# Altium schematic sheet L50T-MAUe.SchDoc
size A3
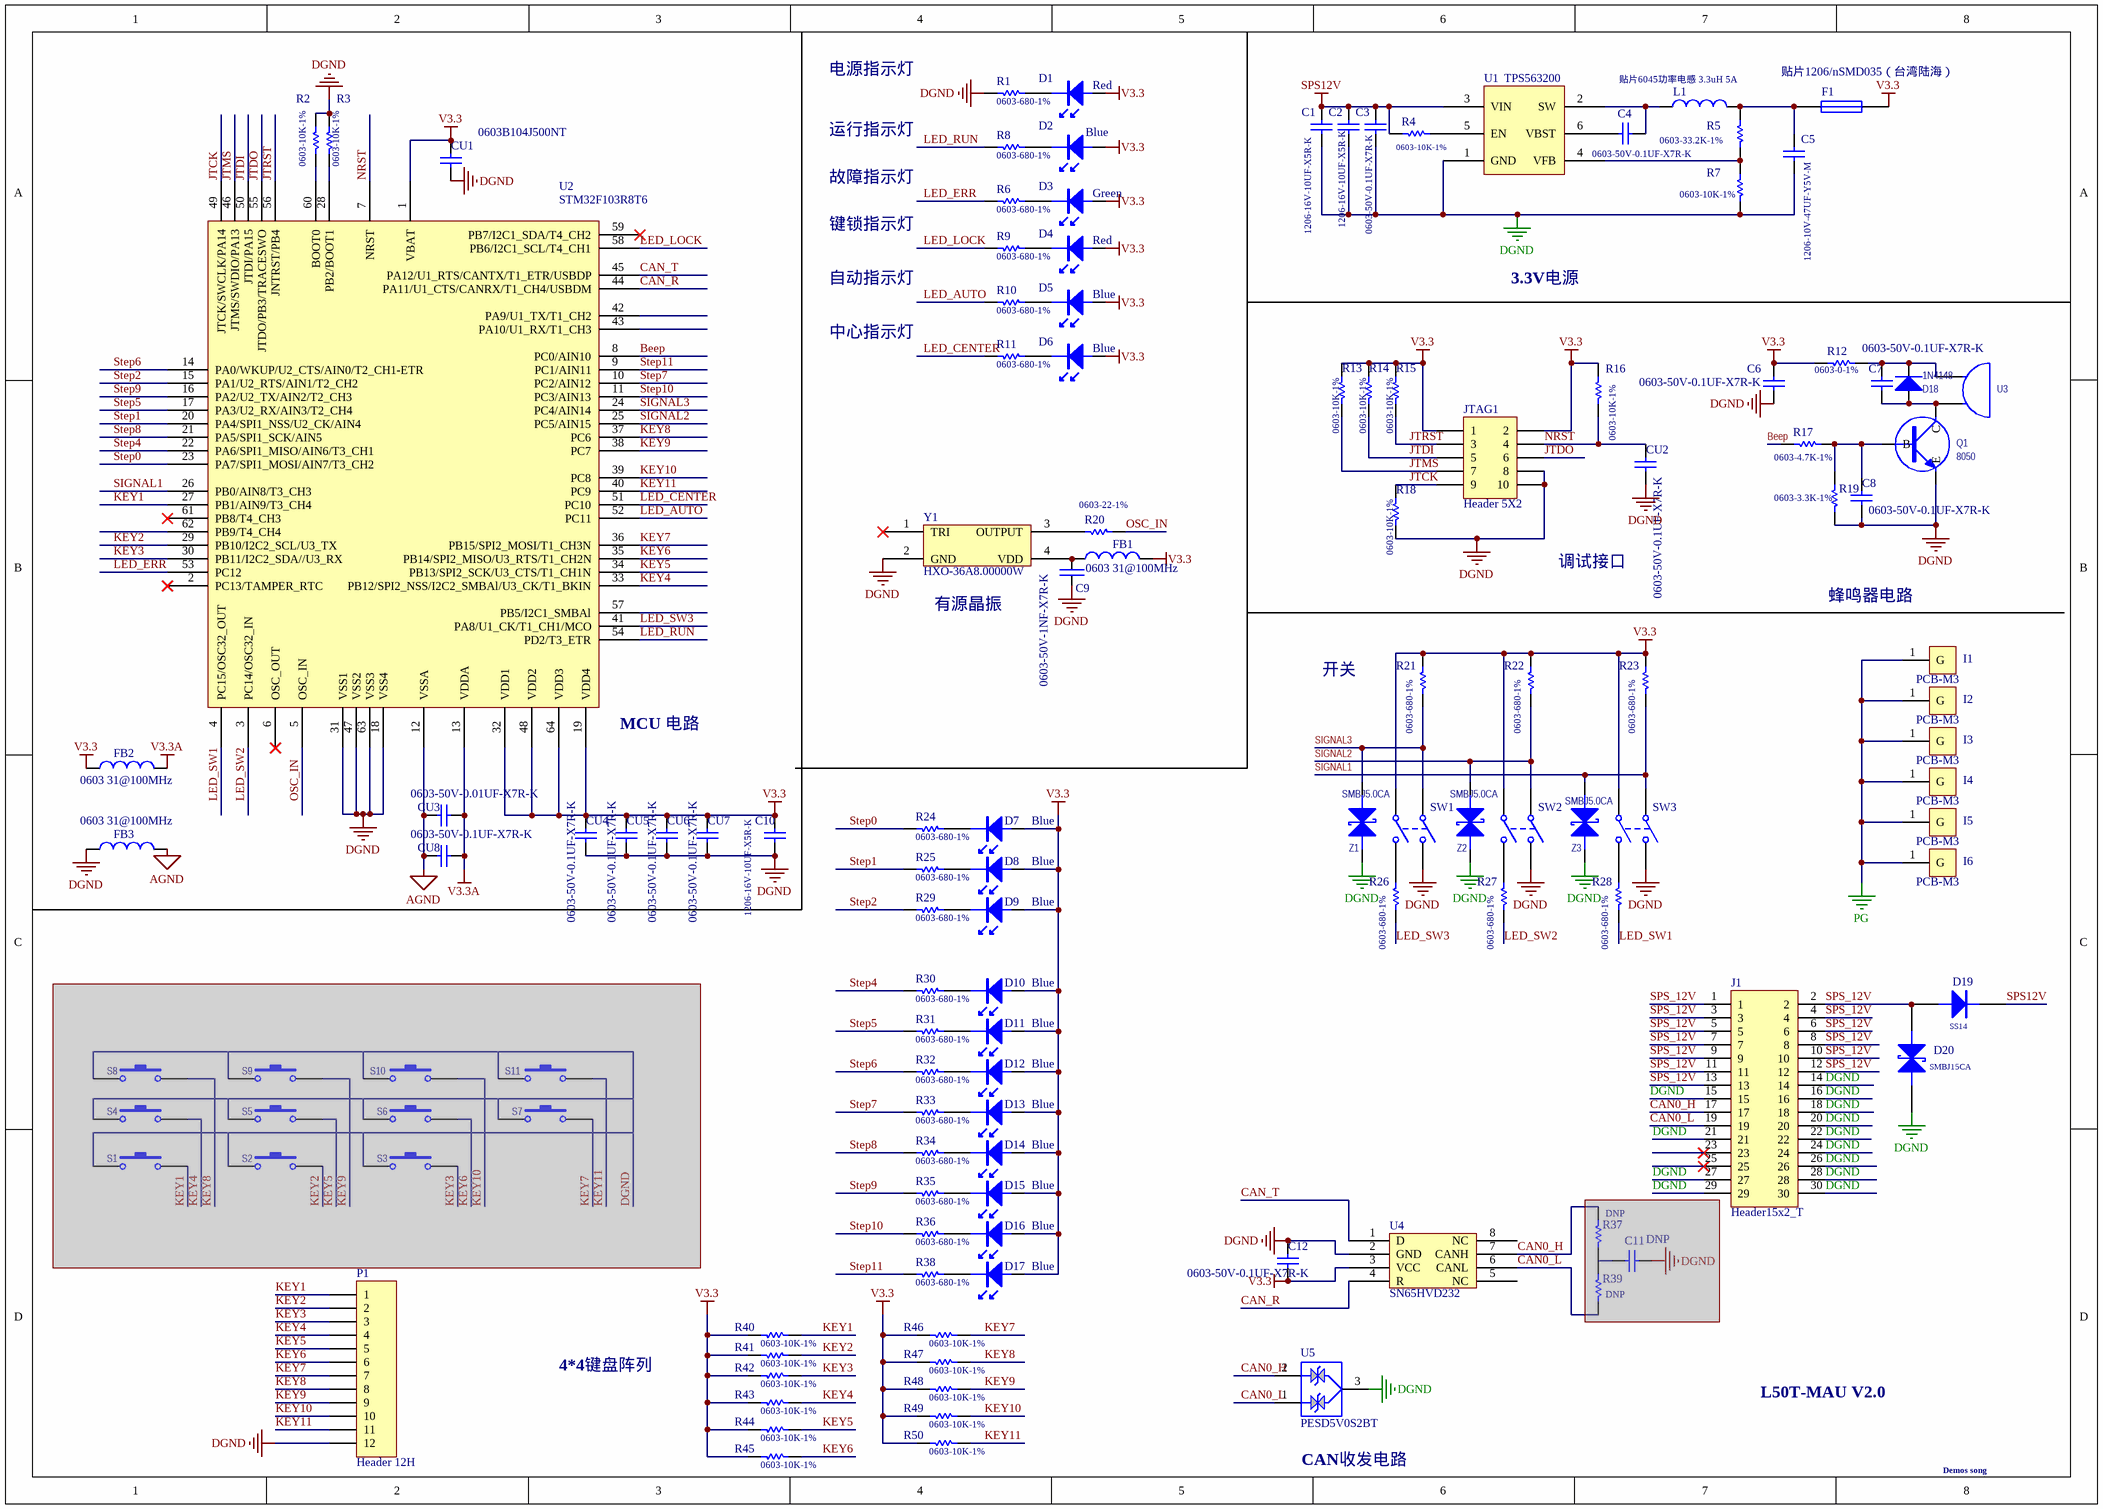
[diagram p0: L50T-MAUe.SchDoc]

## Parts
C1  1206-16V-10UF-X5R-K  [1206C]
C2  1206-16V-10UF-X5R-K  [1206C]
C3  0603-50V-0.1UF-X7R-K  [0603C]
C4  0603-50V-0.1UF-X7R-K  [0603C]
C5  1206-10V-47UF-Y5V-M  [1206C]
C6  0603-50V-0.1UF-X7R-K  [0603C]
C7  0603-50V-0.1UF-X7R-K  [0603C]
C8  0603-50V-0.1UF-X7R-K  [0603C]
C9  0603-50V-1NF-X7R-K  [0603c]
C10  1206-16V-10UF-X5R-K  [1206C]
C11  DNP  [0603C]  (masked out: inside a compile mask, not in the netlist)
C12  0603-50V-0.1UF-X7R-K  [0603C]
CU1  value 0603B104J500NT  [0603C]  (hidden comment: 0603-50V-0.1UF-X7R-K)
CU2  0603-50V-0.1UF-X7R-K  [0603C]
CU3  0603-50V-0.01UF-X7R-K  [0603C]
CU4  0603-50V-0.1UF-X7R-K  [0603C]
CU5  0603-50V-0.1UF-X7R-K  [0603C]
CU6  0603-50V-0.1UF-X7R-K  [0603C]
CU7  0603-50V-0.1UF-X7R-K  [0603C]
CU8  0603-50V-0.1UF-X7R-K  [0603C]
D1  Red  [1206LED-B]
D2  Blue  [1206LED-B]
D3  Green  [1206LED-B]
D4  Red  [1206LED-B]
D5  Blue  [1206LED-B]
D6  Blue  [1206LED-B]
D7  Blue  [LED-KEY]
D8  Blue  [LED-KEY]
D9  Blue  [LED-KEY]
D10  Blue  [LED-KEY]
D11  Blue  [LED-KEY]
D12  Blue  [LED-KEY]
D13  Blue  [LED-KEY]
D14  Blue  [LED-KEY]
D15  Blue  [LED-KEY]
D16  Blue  [LED-KEY]
D17  Blue  [LED-KEY]
D18  1N4148  [SOD-323]
D19  SS14  [SMA]
D20  SMBJ15CA  [SMB-TVS]
F1  贴片1206/nSMD035（台湾陆海）  [1206F]
FB1  0603 31@100MHz  [0603L]
FB2  0603 31@100MHz  [0603L]
FB3  0603 31@100MHz  [0603L]
I1  PCB-M3  [PADS_M3]
I2  PCB-M3  [PADS_M3]
I3  PCB-M3  [PADS_M3]
I4  PCB-M3  [PADS_M3]
I5  PCB-M3  [PADS_M3]
I6  PCB-M3  [PADS_M3]
J1  Header15x2_T  [IDC-30-2.0T]
JTAG1  Header 5X2  [IDC-10-SMT]
L1  贴片6045功率电感 3.3uH 5A  [L-6045]
P1  Header 12H  [XPHD101-12-A01]
Q1  8050  [SOT-23]
R1  0603-680-1%  [0603R]
R2  0603-10K-1%  [0603R]
R3  0603-10K-1%  [0603R]
R4  0603-10K-1%  [0603R]
R5  0603-33.2K-1%  [0603R]
R6  0603-680-1%  [0603R]
R7  0603-10K-1%  [0603R]
R8  0603-680-1%  [0603R]
R9  0603-680-1%  [0603R]
R10  0603-680-1%  [0603R]
R11  0603-680-1%  [0603R]
R12  0603-0-1%  [0603R]
R13  0603-10K-1%  [0603R]
R14  0603-10K-1%  [0603R]
R15  0603-10K-1%  [0603R]
R16  0603-10K-1%  [0603R]
R17  0603-4.7K-1%  [0603R]
R18  0603-10K-1%  [0603R]
R19  0603-3.3K-1%  [0603R]
R20  0603-22-1%  [0603R]
R21  0603-680-1%  [0603R]
R22  0603-680-1%  [0603R]
R23  0603-680-1%  [0603R]
R24  0603-680-1%  [0603R]
R25  0603-680-1%  [0603R]
R26  0603-680-1%  [0603R]
R27  0603-680-1%  [0603R]
R28  0603-680-1%  [0603R]
R29  0603-680-1%  [0603R]
R30  0603-680-1%  [0603R]
R31  0603-680-1%  [0603R]
R32  0603-680-1%  [0603R]
R33  0603-680-1%  [0603R]
R34  0603-680-1%  [0603R]
R35  0603-680-1%  [0603R]
R36  0603-680-1%  [0603R]
R37  DNP  [0603R]  (masked out: inside a compile mask, not in the netlist)
R38  0603-680-1%  [0603R]
R39  DNP  [0603R]  (masked out: inside a compile mask, not in the netlist)
R40  0603-10K-1%  [0603R]
R41  0603-10K-1%  [0603R]
R42  0603-10K-1%  [0603R]
R43  0603-10K-1%  [0603R]
R44  0603-10K-1%  [0603R]
R45  0603-10K-1%  [0603R]
R46  0603-10K-1%  [0603R]
R47  0603-10K-1%  [0603R]
R48  0603-10K-1%  [0603R]
R49  0603-10K-1%  [0603R]
R50  0603-10K-1%  [0603R]
S1  SW-PB  [SKRR]  (value not drawn)  (masked out: inside a compile mask, not in the netlist)
S2  SW-PB  [SKRR]  (value not drawn)  (masked out: inside a compile mask, not in the netlist)
S3  SW-PB  [SKRR]  (value not drawn)  (masked out: inside a compile mask, not in the netlist)
S4  SW-PB  [SKRR]  (value not drawn)  (masked out: inside a compile mask, not in the netlist)
S5  SW-PB  [SKRR]  (value not drawn)  (masked out: inside a compile mask, not in the netlist)
S6  SW-PB  [SKRR]  (value not drawn)  (masked out: inside a compile mask, not in the netlist)
S7  SW-PB  [SKRR]  (value not drawn)  (masked out: inside a compile mask, not in the netlist)
S8  SW-PB  [SKRR]  (value not drawn)  (masked out: inside a compile mask, not in the netlist)
S9  SW-PB  [SKRR]  (value not drawn)  (masked out: inside a compile mask, not in the netlist)
S10  SW-PB  [SKRR]  (value not drawn)  (masked out: inside a compile mask, not in the netlist)
S11  SW-PB  [SKRR]  (value not drawn)  (masked out: inside a compile mask, not in the netlist)
SW1  SW-DPST  [J-19-471]  (value not drawn)
SW2  SW-DPST  [J-19-471]  (value not drawn)
SW3  SW-DPST  [J-19-471]  (value not drawn)
U1  TPS563200  [TSOT23-6]
U2  STM32F103R8T6  [STM-LQFP64_N]
U3  BUZZER  [BUZZ-.28/.46 -SMT]  (value not drawn)
U4  SN65HVD232  [SO-8]
U5  PESD5V0S2BT  [SOT-23]
Y1  HXO-36A8.00000W  [XTAL-C]
Z1  SMBJ5.0CA  [SMB-TVS]
Z2  SMBJ5.0CA  [SMB-TVS]
Z3  SMBJ5.0CA  [SMB-TVS]

## Nets
AGND: CU3.2 CU8.2 FB3.2 U2.12(VSSA)
DGND: C1.1 C2.1 C3.2 C5.1 C6.2 C8.1 C9.2 C10.1 C12.2 CU1.1 CU2.1 CU4.1 CU5.1 CU6.1 CU7.1 D20.1(A) FB3.1 J1.14 J1.15 J1.16 J1.18 J1.20 J1.21 J1.22 J1.24 J1.26 J1.27 J1.28 J1.29 J1.30 JTAG1.8 JTAG1.10 P1.12 Q1.2(E) R1.1 R2.1 R3.1 R7.2 R18.1 R19.1 SW1.2(NO1) SW2.2(NO1) SW3.2(NO1) U1.1(GND) U2.18(VSS4) U2.31(VSS1) U2.47(VSS2) U2.63(VSS3) U4.2(GND) U5.3 Y1.2(GND) Z1.2(K) Z2.2(K) Z3.2(K)
PG: I1.1(G) I2.1(G) I3.1(G) I4.1(G) I5.1(G) I6.1(G)
SPS12V: C1.2 C2.2 C3.1 D19.2 R4.2 U1.3(VIN)
V3.3: C6.1 C10.2 C12.1 CU1.2 CU4.2 CU5.2 CU6.2 CU7.2 D1.1 D2.1 D3.1 D4.1 D5.1 D6.1 D7.1 D8.1 D9.1 D10.1 D11.1 D12.1 D13.1 D14.1 D15.1 D16.1 D17.1 F1.2 FB1.2 FB2.1 JTAG1.1 JTAG1.2 R12.2 R13.2 R14.2 R15.2 R16.2 R21.2 R22.2 R23.2 R40.1 R41.1 R42.1 R43.1 R44.1 R45.1 R46.1 R47.1 R48.1 R49.1 R50.1 SW1.3(COMMON2) SW2.3(COMMON2) SW3.3(COMMON2) U2.1(VBAT) U2.19(VDD4) U2.32(VDD1) U2.48(VDD2) U2.64(VDD3) U4.3(VCC)
V3.3A: CU3.1 CU8.1 FB2.2 U2.13(VDDA)
Beep: R17.1 U2.8(PC0/AIN10)
CAN0_H: J1.17 U4.7(CANH) U5.2
CAN0_L: J1.19 U4.6(CANL) U5.1
CAN_R: U2.44(PA11/U1_CTS/CANRX/T1_CH4/USBDM) U4.4(R)
CAN_T: U2.45(PA12/U1_RTS/CANTX/T1_ETR/USBDP) U4.1(D)
JTCK: JTAG1.9 R18.2 U2.49(JTCK/SWCLK/PA14)
JTDI: JTAG1.5 R14.1 U2.50(JTDI/PA15)
JTDO: JTAG1.6 U2.55(JTDO/PB3/TRACESWO)
JTMS: JTAG1.7 R13.1 U2.46(JTMS/SWDIO/PA13)
JTRST: JTAG1.3 R15.1 U2.56(JNTRST/PB4)
KEY1: P1.1 R40.2 U2.27(PB1/AIN9/T3_CH4)
KEY2: P1.2 R41.2 U2.29(PB10/I2C2_SCL/U3_TX)
KEY3: P1.3 R42.2 U2.30(PB11/I2C2_SDA//U3_RX)
KEY4: P1.4 R43.2 U2.33(PB12/SPI2_NSS/I2C2_SMBAl/U3_CK/T1_BKIN)
KEY5: P1.5 R44.2 U2.34(PB13/SPI2_SCK/U3_CTS/T1_CH1N)
KEY6: P1.6 R45.2 U2.35(PB14/SPI2_MISO/U3_RTS/T1_CH2N)
KEY7: P1.7 R46.2 U2.36(PB15/SPI2_MOSI/T1_CH3N)
KEY8: P1.8 R47.2 U2.37(PC6)
KEY9: P1.9 R48.2 U2.38(PC7)
KEY10: P1.10 R49.2 U2.39(PC8)
KEY11: P1.11 R50.2 U2.40(PC9)
LED_AUTO: R10.1 U2.52(PC11)
LED_CENTER: R11.1 U2.51(PC10)
LED_ERR: R6.1 U2.53(PC12)
LED_LOCK: R9.1 U2.58(PB6/I2C1_SCL/T4_CH1)
LED_RUN: R8.1 U2.54(PD2/T3_ETR)
LED_SW1: R28.1 U2.4(PC15/OSC32_OUT)
LED_SW2: R27.1 U2.3(PC14/OSC32_IN)
LED_SW3: R26.1 U2.41(PA8/U1_CK/T1_CH1/MCO)
NRST: CU2.2 JTAG1.4 R16.1 U2.7(NRST)
OSC_IN: R20.1 U2.5(OSC_IN)
SIGNAL1: R23.1 SW3.1(COMMON1) U2.26(PB0/AIN8/T3_CH3) Z3.1(A)
SIGNAL2: R22.1 SW2.1(COMMON1) U2.25(PC5/AIN15) Z2.1(A)
SIGNAL3: R21.1 SW1.1(COMMON1) U2.24(PC4/AIN14) Z1.1(A)
SPS_12V: D19.1 D20.2(K) J1.1 J1.2 J1.3 J1.4 J1.5 J1.6 J1.7 J1.8 J1.9 J1.10 J1.11 J1.12 J1.13
Step0: R24.1 U2.23(PA7/SPI1_MOSI/AIN7/T3_CH2)
Step1: R25.1 U2.20(PA4/SPI1_NSS/U2_CK/AIN4)
Step2: R29.1 U2.15(PA1/U2_RTS/AIN1/T2_CH2)
Step4: R30.1 U2.22(PA6/SPI1_MISO/AIN6/T3_CH1)
Step5: R31.1 U2.17(PA3/U2_RX/AIN3/T2_CH4)
Step6: R32.1 U2.14(PA0/WKUP/U2_CTS/AIN0/T2_CH1-ETR)
Step7: R33.1 U2.10(PC2/AIN12)
Step8: R34.1 U2.21(PA5/SPI1_SCK/AIN5)
Step9: R35.1 U2.16(PA2/U2_TX/AIN2/T2_CH3)
Step10: R36.1 U2.11(PC3/AIN13)
Step11: R38.1 U2.9(PC1/AIN11)
NetC4_1: C4.1 L1.1 U1.2(SW)
NetC4_2: C4.2 U1.6(VBST)
NetC5_2: C5.2 F1.1 L1.2 R5.1
NetC7_1: C7.1 D18.2(K) R12.1 U3.1(A)
NetC7_2: C7.2 D18.1(A) Q1.3(C) U3.2(B)
NetC8_2: C8.2 Q1.1(B) R17.2 R19.2
NetC9_1: C9.1 FB1.1 Y1.4(VDD)
NetD1_2: D1.2 R1.2
NetD2_2: D2.2 R8.2
NetD3_2: D3.2 R6.2
NetD4_2: D4.2 R9.2
NetD5_2: D5.2 R10.2
NetD6_2: D6.2 R11.2
NetD7_2: D7.2 R24.2
NetD8_2: D8.2 R25.2
NetD9_2: D9.2 R29.2
NetD10_2: D10.2 R30.2
NetD11_2: D11.2 R31.2
NetD12_2: D12.2 R32.2
NetD13_2: D13.2 R33.2
NetD14_2: D14.2 R34.2
NetD15_2: D15.2 R35.2
NetD16_2: D16.2 R36.2
NetD17_2: D17.2 R38.2
NetR2_2: R2.2 U2.60(BOOT0)
NetR3_2: R3.2 U2.28(PB2/BOOT1)
NetR4_1: R4.1 U1.5(EN)
NetR5_2: R5.2 R7.1 U1.4(VFB)
NetR20_2: R20.2 Y1.3(OUTPUT)
NetR26_2: R26.2 SW1.4(NO2)
NetR27_2: R27.2 SW2.4(NO2)
NetR28_2: R28.2 SW3.4(NO2)

Not connected (* = marked no-connect by the designer): J1 23* 25*; U2 2(PC13/TAMPER_RTC)* 6(OSC_OUT)* 42(PA9/U1_TX/T1_CH2) 43(PA10/U1_RX/T1_CH3) 57(PB5/I2C1_SMBAl) 59(PB7/I2C1_SDA/T4_CH2)* 61(PB8/T4_CH3)* 62(PB9/T4_CH4); U4 5(NC) 8(NC); Y1 1(TRI)*

## Notes on the sheet
- 电源指示灯
- 故障指示灯
- 运行指示灯
- 键锁指示灯
- 自动指示灯
- 3.3V电源
- 中心指示灯
- 调试接口
- (near Y1) 有源晶振
- 蜂鸣器电路
- 开关
- (near U2) MCU 电路
- 4*4键盘阵列
- L50T-MAU V2.0
- (near U5) CAN收发电路
- Demos song

## Library data of the parts
C1-C5 C10 = Cap: Capacitor; Value: 0.1u; Published: 8-Jun-2000; LatestRevisionDate: 17-Jul-2002; LatestRevisionNote: Re-released for DXP Platform.; PackageReference: RAD-0.3; Publisher: Altium Limited; PackageDescription: Radial Cap, Thru-Hole; 2 Leads; 0.3 in Pin Spacing
C6-C8 CU2 = Cap: Capacitor; Value: 0603B472J500NT; Published: 8-Jun-2000; LatestRevisionDate: 17-Jul-2002; LatestRevisionNote: Re-released for DXP Platform.; PackageReference: RAD-0.3; Publisher: Altium Limited
C9 = CAP: Capacitor
C11 C12 = Cap: Capacitor; Value: 0603B104J500NT; Published: 8-Jun-2000; LatestRevisionDate: 17-Jul-2002; LatestRevisionNote: Re-released for DXP Platform.; PackageReference: RAD-0.3; Publisher: Altium Limited
CU1 = Cap: Capacitor; Published: 8-Jun-2000; LatestRevisionDate: 17-Jul-2002; LatestRevisionNote: Re-released for DXP Platform.; PackageReference: RAD-0.3; Publisher: Altium Limited
CU3 = Cap: Capacitor; Value: 1nF; Published: 8-Jun-2000; LatestRevisionDate: 17-Jul-2002; LatestRevisionNote: Re-released for DXP Platform.; PackageReference: RAD-0.3; Publisher: Altium Limited; Type: 0603B102J500NT
CU4-CU7 = Cap: Capacitor; Value: 100nF; Published: 8-Jun-2000; LatestRevisionDate: 17-Jul-2002; LatestRevisionNote: Re-released for DXP Platform.; PackageReference: RAD-0.3; Publisher: Altium Limited; Type: 0603B104J500NT
CU8 = Cap: Capacitor; Value: 1206B/105J500NT; Published: 8-Jun-2000; LatestRevisionDate: 17-Jul-2002; LatestRevisionNote: Re-released for DXP Platform.; PackageReference: RAD-0.3; Publisher: Altium Limited; Type: 1uF
D1-D17 = LED
D18 = Diode 1N4148: High Conductance Fast Diode; Published: 8-Jun-2000; LatestRevisionDate: 17-Jul-2002; LatestRevisionNote: Re-released for DXP Platform.; DatasheetVersion: 1997; PackageReference: DO-35; Publisher: Altium Limited; Code_JEDEC: DO-204-AH; ComponentLink1Description: Manufacturer Link; ComponentLink1URL: http://www.fairchildsemi.com/; ComponentLink2Description: Datasheet; ComponentLink2URL: http://www.fairchildsemi.com/ds/1N%2F1N4148.pdf
D19 = DIODE
D20 Z1-Z3 = TVSC
F1 = Fuse 1: Fuse; Published: 8-Jun-2000; LatestRevisionDate: 17-Jul-2002; LatestRevisionNote: Re-released for DXP Platform.; PackageReference: PIN-W2/E2.8; Publisher: Altium Limited; PackageDescription: Thru-Hole; 2 Leads
FB1-FB3 = Inductor: Code_IEC: 1005; Value: 31Ω; Published: 8-Jun-2000; LatestRevisionDate: 29-May-2009; LatestRevisionNote: IPC-7351 Footprint Added.; PackageReference: 0402-A; Publisher: Altium Limited; PackageDescription: Chip Inductor; Code_JEITA: 0402
I1-I6 = PCB-M
J1 = Header15x2
JTAG1 = Header 5X2: Header, 5-Pin, Dual row; LatestRevisionDate: 17-Jul-2002; LatestRevisionNote: Re-released for DXP Platform.; Publisher: Altium Limited
L1 = Inductor: Code_IEC: 1005; Published: 8-Jun-2000; LatestRevisionDate: 29-May-2009; LatestRevisionNote: IPC-7351 Footprint Added.; PackageReference: 0402-A; Publisher: Altium Limited; PackageDescription: Chip Inductor; Code_JEITA: 0402
P1 = Header 12H: Header, 12-Pin, Right Angle; LatestRevisionDate: 17-Jul-2002; LatestRevisionNote: Re-released for DXP Platform.; Publisher: Altium Limited
Q1 = NPN: NPN Transistor
R1-R50 = Res1: Resistor; Value: 1K; Published: 8-Jun-2000; LatestRevisionDate: 17-Jul-2002; LatestRevisionNote: Re-released for DXP Platform.; PackageReference: AXIAL-0.3; Publisher: Altium Limited
S1-S11 = SW-PB: Switch; Published: 24-Mar-1999; LatestRevisionDate: 17-Jul-2002; LatestRevisionNote: Re-released for DXP Platform.; PackageReference: SPST-2; Publisher: Altium Limited
SW1-SW3 = SW-DPST: Double-Pole, Single-Throw Switch; Published: 24-Mar-1999; LatestRevisionDate: 17-Jul-2002; LatestRevisionNote: Re-released for DXP Platform.; PackageReference: DPST-4; Publisher: Altium Limited; PackageDescription: Switch; 4 Leads
U1 = TPS562200
U2 = STM32F103R8T6: LQFP64
U3 = BUZZER: TMB12A03
U5 = NUP2105L: TVS protect
Y1 = osc
U4 = SN65HVD232: Supplier 1: Digi-Key; Supplier Part Number 1: 296-12282-5-ND